# Altium schematic sheet Sheet1.SchDoc
size A4; Organization: Blinkinlabs, LLC
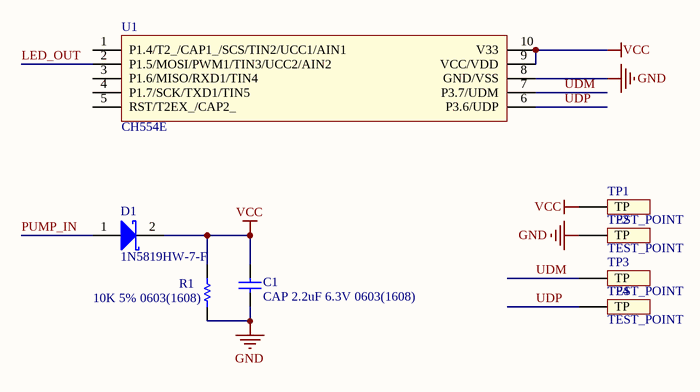
[diagram p0: Sheet1.SchDoc]

## Parts
C1  CAP 2.2uF 6.3V 0603(1608)  [CAPC0603(1608)100_L]
D1  1N5819HW-7-F  [DIOD-SOD-123-2_V]
R1  10K 5% 0603(1608)  [RESC0603(1608)_N]
TP1  TEST_POINT  [TP-SMD-1mm]  (no BOM)
TP2  TEST_POINT  [TP-SMD-1mm]  (no BOM)
TP3  TEST_POINT  [TP-SMD-1mm]  (no BOM)
TP4  TEST_POINT  [TP-SMD-1mm]  (no BOM)
U1  CH554E  [LC-MSOP-10]

## Nets
GND: C1.1 R1.1 TP2.1(TP) U1.8(GND/VSS)
VCC: C1.2 D1.2(K) R1.2 TP1.1(TP) U1.9(VCC/VDD) U1.10(V33)
LED_OUT: U1.2(P1.5/MOSI/PWM1/TIN3/UCC2/AIN2)
PUMP_IN: D1.1(A)
UDM: TP3.1(TP) U1.7(P3.7/UDM)
UDP: TP4.1(TP) U1.6(P3.6/UDP)

Not connected (* = marked no-connect by the designer): U1 1(P1.4/T2_/CAP1_/SCS/TIN2/UCC1/AIN1) 3(P1.6/MISO/RXD1/TIN4) 4(P1.7/SCK/TXD1/TIN5) 5(RST/T2EX_/CAP2_)

## Notes on the sheet
- Title:
- Project:
- Revision:
- Date:
- Time:
- Sheet
- of

## Library data of the parts
C1 = CMP-1035-02754-1: CAP 2.2uF 6.3V ±10% 0603 (1608 Metric) Thickness 1mm SMD; Case-EIA: 0603; Tolerance: Â±10%; Case-Metric: 1608; Technology: SMT; Value: 2.2uF; Rated Voltage: 6.3 V; Max Thickness: 1 mm
D1 = CMP-0303-00003-1: 1.0 A Surface Mount Schottky Barrier Rectifier, 40 V, -65 to 125 degC, 2-Pin SOD-123 Package, RoHS, Tape and Reel; Manufacturer: Diodes Inc; @ VR (V): 40; @ Terminal Temperature TT (degC): 90; Maximum Average Rectified Current IO (A): 1; Total Capacitance CT (pF): 50; Peak Forward Surge Current IFSM (A): 25; Forward Voltage Drop VF (V): 0.45; VR (RMS) (V): 28; RoHS: TRUE; PartNumber: 1N5819HW-7-F; ComponentLink2URL: http://www.diodes.com/datasheets/ds30217.pdf; PackageDescription: 2-Pin SOD-123, Body 2.7 x 1.55 mm, Pitch 3.7 mm; @ IF (A): 1; Operating and Storage Temperature Range: -65 to 125 degC; ComponentLink1Description: Manufacturer URL; ComponentLink2Description: Datasheet; ComponentLink1URL: http://www.diodes.com/; Mounting Technology: Surface Mount; DatasheetVersion: Rev. 15-2; PackageReference: SOD-123-2; Maximum Reverse Current IR (uA): 50; Peak Repetitive Reverse Voltage VRRM (V): 40; Packing: Tape and Reel
R1 = CMP-1012-00098-1: 10K 0.1W 5% 0603 (1608 Metric)  SMD; Case-EIA: 0603; Value: 10000.00 Ohm; Case-Metric: 1608; Technology: SMT; Tolerance: 5 %; Power: 0.1 W
TP1-TP4 = TEST_POINT: Test point
U1 = CH554E: 8-bit enhanced USB microcontroller; Manufacturer: WCH; PartNumber: CH554E